# EAGLE design ssop8_breakout (EAGLE 9.2.2)
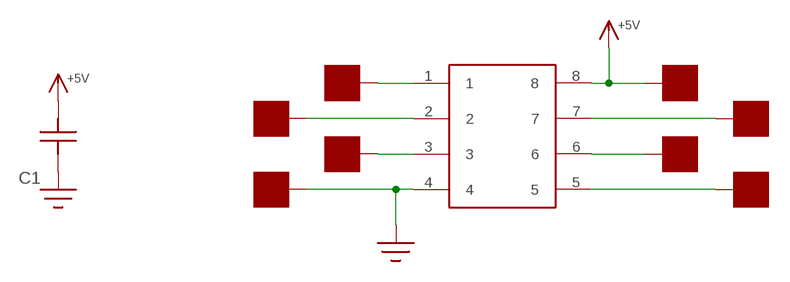
[diagram p0: schematic, sheet 1]

## Parts
C1  C0603  [C0603]
IC1  IC-8PINSSOP8  [SSOP8]
U$1  PAD50MIL  [PAD_50MIL]
U$2  PAD50MIL  [PAD_50MIL]
U$3  PAD50MIL  [PAD_50MIL]
U$4  PAD50MIL  [PAD_50MIL]
U$5  PAD50MIL  [PAD_50MIL]
U$6  PAD50MIL  [PAD_50MIL]
U$7  PAD50MIL  [PAD_50MIL]
U$8  PAD50MIL  [PAD_50MIL]

## Nets
+5V: C1.P$1 IC1.8 U$1.P$1
GND: C1.P$2 IC1.4 U$8.P$1
N$1: IC1.1 U$5.P$1
N$2: IC1.2 U$6.P$1
N$3: IC1.3 U$7.P$1
N$6: IC1.7 U$2.P$1
N$7: IC1.6 U$3.P$1
N$8: IC1.5 U$4.P$1

## Library data of the parts
C1 = yapo:C
IC1 = yapo:IC-8PIN
U$1-U$8 = yapo:PAD

## Board
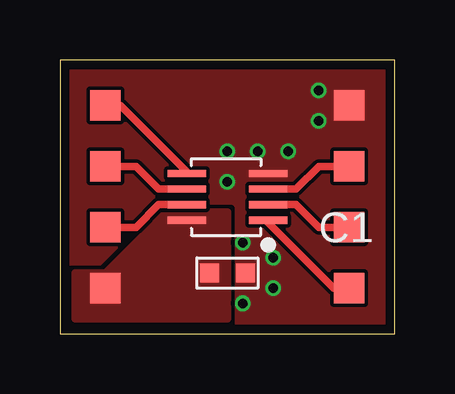
[diagram p1: board, top side]
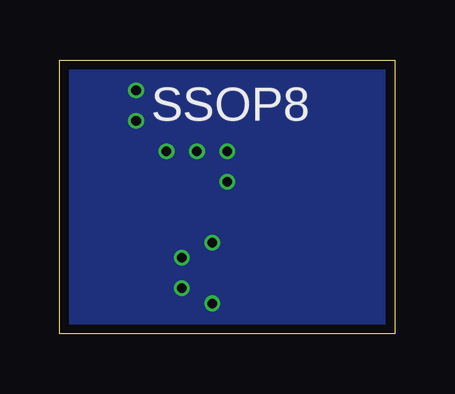
[diagram p2: board, bottom side, seen from below]

Size 13.97 x 11.43 mm. Coordinates in mm from the lower left corner, seen from the top.
Outline: 0,0 13.97,0 13.97,11.43 0,11.43 0,0
Copper layers (1*16): Top 0.035559375mm / dielectric 1.6mm / Bottom 0.035559375mm
Design rules "oshpark-2layer *": minimum track width 6mil, minimum drill 10mil, track to track 6mil, track to pad 6mil, pad to pad 6mil, via to via 6mil, smd to smd 6mil, copper to edge 15mil, drill to drill 6mil, minimum pad ring 5mil, minimum via ring 5mil, stop-mask expansion 2.5mil, vias tented up to drill 30mil, thermal gap 10mil

### Footprints (pad centres in the part's own frame; a part is rotated, then mirrored left to right if it is on the bottom)
C0603 = smd 0.8 x 0.8: P$1 -0.75,0; P$2 0.75,0
SSOP8 = smd 0.3 x 1.6: 1 -0.975,-1.7; 2 -0.325,-1.7; 3 0.325,-1.7; 4 0.975,-1.7; 5 0.975,1.7; 6 0.325,1.7; 7 -0.325,1.7; 8 -0.975,1.7
PAD_50MIL = smd 1.27 x 1.27: P$1 0,0

### Placement (x,y rotation side)
C1  6.99,2.54 0 top
IC1  6.99,5.71 90 top
U$1  1.91,1.91 0 top
U$2  1.91,4.45 0 top
U$3  1.91,6.99 0 top
U$4  1.91,9.53 0 top
U$5  12.06,1.91 0 top
U$6  12.06,4.45 0 top
U$7  12.06,6.99 0 top
U$8  12.06,9.53 0 top

### Tracks (layer width: path | path; a pad name or v marks a point on that pad's centre or on a via)
+5V
  pour Top (no thermals): 0.64,0.64 6.99,0.64 6.99,5.08 4.45,5.08 1.91,2.54 0.64,2.54
GND  (via drill 0.4)
  other vias: 8.26,7.62 9.53,7.62 6.99,6.35 6.99,7.62 8.89,3.17 8.89,1.91 7.62,3.81 7.62,1.27 10.79,10.16 10.79,8.89
  pour Top (rank 2, no thermals): 0,0 13.97,0 13.97,11.43 0,11.43
  pour Bottom: 0,0 13.97,0 13.97,11.43 0,11.43
N$1
  Top 0.305: IC1.1 8.69,4.65 11.43,1.91 U$5.P$1
N$2
  Top 0.305: IC1.2 9.85,5.39 10.79,4.45 U$6.P$1
N$3
  Top 0.305: IC1.3 9.85,6.04 10.79,6.99 U$7.P$1
N$6
  Top 0.305: IC1.7 4.12,5.39 3.17,4.45 U$2.P$1
N$7
  Top 0.305: IC1.6 4.12,6.04 3.17,6.99 U$3.P$1
N$8
  Top 0.305: 5.08,6.69 IC1.5 5.29,6.78 2.54,9.53 U$4.P$1

### Text on the board
bPlace: SSOP8